# Altium project ZVSChargeSource.PrjPCB
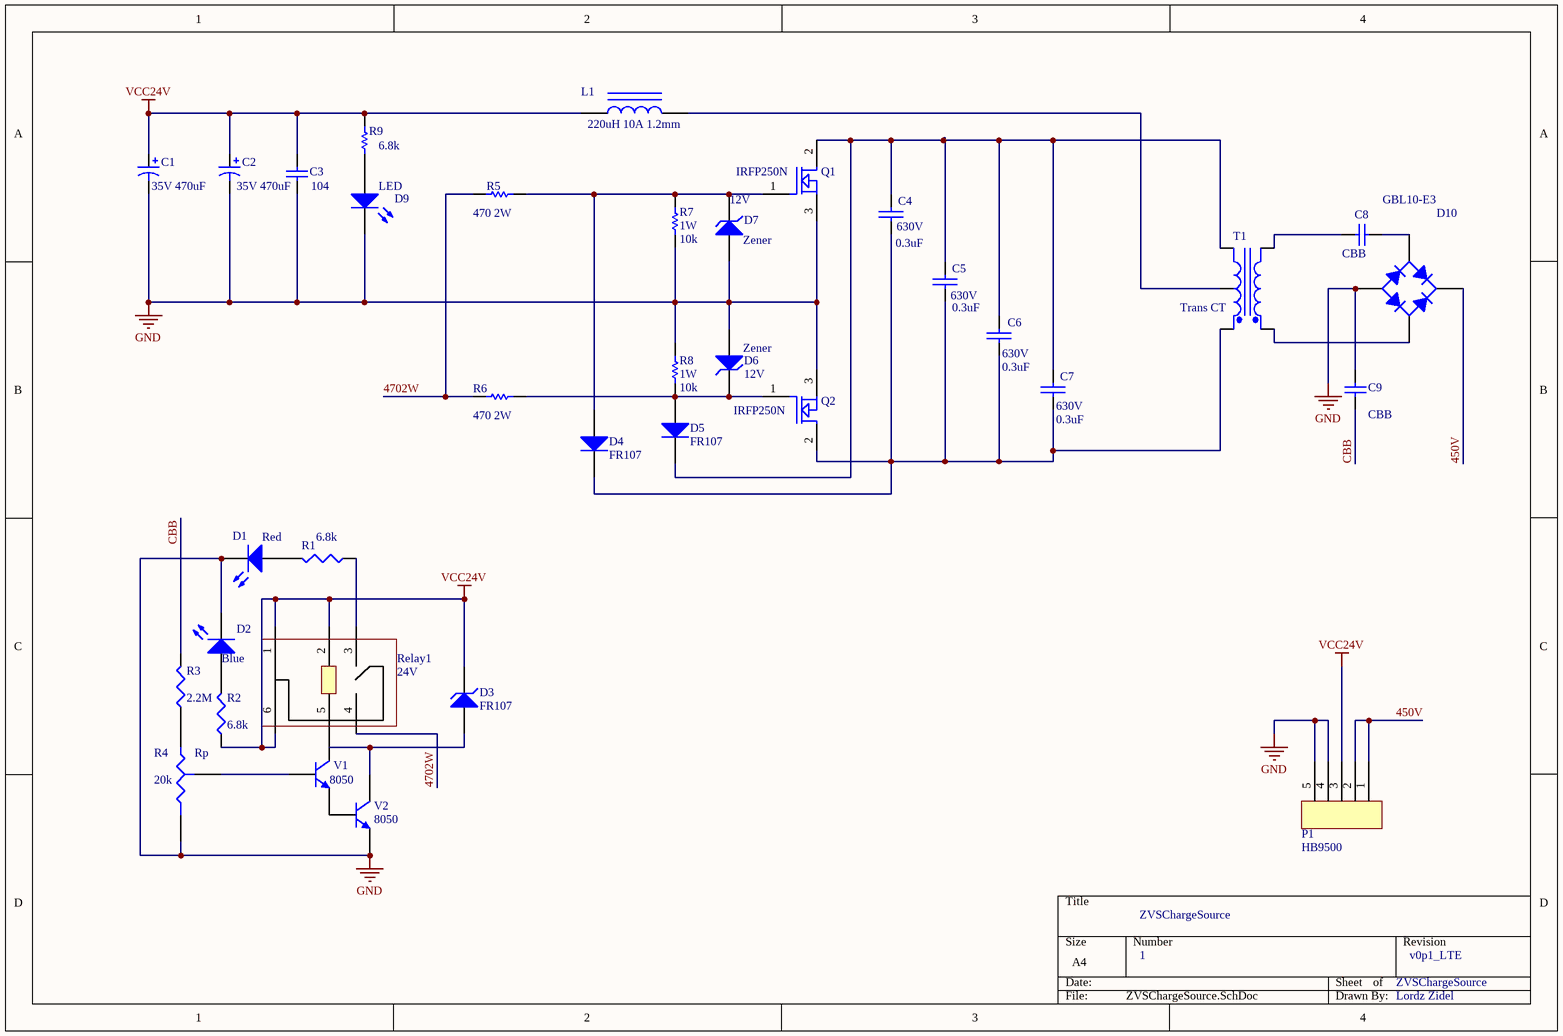
[diagram p0: ZVSChargeSource.SchDoc]
1 sheet, 35 parts. Net scope: global (net labels, ports and power ports of the same name join across sheets).

## Sheet ZVSChargeSource.SchDoc: ZVSChargeSource
size A4; Author: Lordz Zidel; Engineer: Lordz Zidel; Organization: T.WKVER; DocumentNumber: 1; Revision: v0p1_LTE; SheetNumber: 1; DocumentName: ZVSChargeSource; ProjectName: ZVSChargeSource

### Parts
C1  value 35V 470uF  [C4_5_10mm]
C2  value 35V 470uF  [C4_5_10mm]
C3  value 104  [RAD-0.3]
C4  value 630V  Capacitance: 0.3uF  [MKP_Capacitor]
C5  value 630V  Capacitance: 0.3uF  [MKP_Capacitor]
C6  value 630V  Capacitance: 0.3uF  [MKP_Capacitor]
C7  value 630V  Capacitance: 0.3uF  [MKP_Capacitor]
C8  value CBB  [MKP_Capacitor]
C9  value CBB  [MKP_Capacitor]
D1  (no value)  [0805]
D2  (no value)  [0805]
D3  FR107  [DIODE-0.4]
D4  FR107  [DIODE-0.4]
D5  FR107  [DIODE-0.4]
D6  12V  [DIODE-0.4]
D7  12V  [DIODE-0.4]
D9  (no value)  [0805]
D10  GBL10-E3  [GBL10-E3]
L1  value 220uH 10A 1.2mm  [HBL_30_10_H]
P1  HB9500  [CJ_10x5]
Q1  IRFP250N  [TO-247AC_ZCEDGE]
Q2  IRFP250N  [TO-247AC_ZCEDGE]
R1  value 6.8k  [0805R]
R2  value 6.8k  [0805R]
R3  value 2.2M  [0805R]
R4  Rp  value 20k  [ResTap3296]
R5  value 470 2W  [2WZC]
R6  value 470 2W  [2WZC]
R7  1W  value 10k  [1WZC]
R8  1W  value 10k  [1WZC]
R9  value 6.8k  [AXIAL-0.3]
Relay1  Relay?  [Relay_HK4100F_6p]  (value not drawn)
T1  Trans CT  [TRF_5]
V1  8050  [sot-23]
V2  8050  [sot-23]

### Nets
GND: C1.2 C2.2 C3.1 C9.2 D1.2(K) D2.2(K) D6.1(A) D7.1(A) D9.2(K) D10.3(A) P1.4 P1.5 Q1.3(S) Q2.3(S) R4.2(B) R7.2 R8.1 V2.2(E)
VCC24V: C1.1 C2.1 C3.2 D3.2(K) L1.1 P1.3 R2.1 R9.2 Relay1.1 Relay1.2 Relay1.6
450V: D10.1(K) P1.1 P1.2
4702W: R5.2 R6.2 Relay1.4
CBB: C9.1 R3.2
NetC4_1: C4.1 C5.1 C6.1 C7.1 D5.2(K) Q1.2(D) T1.5(Sec-)
NetC4_2: C4.2 C5.2 C6.2 C7.2 D4.2(K) Q2.2(D) T1.3(Sec+)
NetC8_1: C8.1 T1.2(Pri-)
NetC8_2: C8.2 D10.4(C)
NetD1_1: D1.1(A) R1.2
NetD2_1: D2.1(A) R2.2
NetD3_1: D3.1(A) V2.3(C)
NetD4_1: D4.1(A) D7.2(K) Q1.1(G) R5.1 R7.1
NetD5_1: D5.1(A) D6.2(K) Q2.1(G) R6.1 R8.2
NetD9_1: D9.1(A) R9.1
NetD10_2: D10.2(C) T1.1(Pri+)
NetL1_2: L1.2 T1.4(SecCT)
NetR1_1: R1.1 Relay1.3
NetR3_1: R3.1 R4.1(A)
NetR4_3: R4.3(TAP) V1.1(B)
NetRelay1_5: Relay1.5 V1.3(C)
NetV1_2: V1.2(E) V2.1(B)

### Notes on the sheet
- (near D9) LED
- (near D7) Zener
- (near D6) Zener
- (near D1) Red
- (near D2) Blue
- 24V

### Library data of the parts
C1 C2 = Cap Pol1: Polarized Capacitor (Radial); pin to pad: 1>2 2>1; Published: 8-Jun-2000; LatestRevisionDate: 17-Jul-2002; LatestRevisionNote: Re-released for DXP Platform.; PackageReference: RB7.6-15; Publisher: Altium Limited; PackageDescription: Polarized Capacitor (Radial); 2 Leads
C3 C8 C9 = Cap: Capacitor; Published: 8-Jun-2000; LatestRevisionDate: 17-Jul-2002; LatestRevisionNote: Re-released for DXP Platform.; PackageReference: RAD-0.3; Publisher: Altium Limited; PackageDescription: Radial Cap, Thru-Hole; 2 Leads; 0.3 in Pin Spacing
C4-C7 = 普通电容: Capacitor
D1 D2 = LED2: Typical RED, GREEN, YELLOW, AMBER GaAs LED; Published: 8-Jun-2000; LatestRevisionDate: 17-Jul-2002; LatestRevisionNote: Re-released for DXP Platform.; PackageVersion: Feb-2002; PackageReference: 3.2X1.6X1.1; Publisher: Altium Limited; PackageDescription: SM LED; 2 Flat Leads
D3 D6 D7 = D Zener: Zener Diode; Published: 8-Jun-2000; LatestRevisionDate: 17-Jul-2002; LatestRevisionNote: Re-released for DXP Platform.; PackageReference: DIODE-0.7; Publisher: Altium Limited; PackageDescription: Diode, Thru-Hole; 2 Leads; 0.7 in Pin Spacing
D4 D5 = Diode 1N4007: 1 Amp General Purpose Rectifier; Published: 8-Jun-2000; LatestRevisionDate: 17-Jul-2002; LatestRevisionNote: Re-released for DXP Platform.; DatasheetVersion: 1998; PackageVersion: Aug-1999; PackageReference: DO-41; Publisher: Altium Limited; PackageDescription: Diode, Axial; Body 5.2 x 2.7 mm (LxDia. max), Lead Dia. 0.86 mm (max); Code_JEDEC: DO-204-AL; ComponentLink1Description: Manufacturer Link; ComponentLink1URL: http://www.fairchildsemi.com/; ComponentLink2Description: Datasheet; ComponentLink2URL: http://www.fairchildsemi.com/ds/1N%2F1N4001.pdf
D9 = LED3: Typical BLUE SiC LED; Published: 8-Jun-2000; LatestRevisionDate: 17-Dec-2003; LatestRevisionNote: PCB Footprint replaced.; DatasheetVersion: 16-Apr-2002; PackageVersion: 16-Apr-2002; PackageReference: 3.5X2.8X1.9; Publisher: Altium Limited; PackageDescription: SM LED; 2 C-Bend Leads; Body 3.5 x 2.8 x 1.9 mm, inc leads (LxWxH typ)
D10 = Bridge1: Full Wave Diode Bridge; Published: 8-Jun-2000; LatestRevisionDate: 29-May-2009; LatestRevisionNote: Sch pins A & K swapped.; DatasheetVersion: E2732B; PackageReference: D-38; Publisher: Altium Limited; PackageDescription: Bridge Rectifier; 4 Terminals; Body 9.4 x 9.4 mm (typ); Pitch 5.08 mm
L1 = Inductor Iron: Magnetic-Core Inductor; Published: 24-Mar-1999; LatestRevisionDate: 17-Jul-2002; LatestRevisionNote: Re-released for DXP Platform.; PackageReference: AXIAL-0.9; Publisher: Altium Limited; PackageDescription: Axial Device, Thru-Hole; 2 Leads; 0.9 in Pin Spacing
P1 = WJ5P_381
Q1 Q2 = MOSFET N: pin to pad: 1>G 2>D 3>S; Max Voltage: 200V; Max Current: 50A
R1-R3 = Res3: Resistor; Published: 8-Jun-2000; LatestRevisionDate: 29-May-2009; LatestRevisionNote: IPC-7351 Footprint Added.; PackageReference: J1-0603; Publisher: Altium Limited; PackageDescription: Chip Resistor
R4 = Res Tap: Tapped Resistor; Sim Note: Enter the Resistance value and the set point into parameter fields.; Set Position: 0.5; Published: 24-Mar-1999; LatestRevisionDate: 17-Jul-2002; LatestRevisionNote: Re-released for DXP Platform.; PackageReference: VR3; Publisher: Altium Limited; PackageDescription: Variable Resistor, Thru-Hole; 3 Leads
R5-R9 = Res1: Resistor; Published: 8-Jun-2000; LatestRevisionDate: 17-Jul-2002; LatestRevisionNote: Re-released for DXP Platform.; PackageReference: AXIAL-0.3; Publisher: Altium Limited; PackageDescription: Axial Device, Thru-Hole; 2 Leads; 0.3 in Pin Spacing
Relay1 = Relay_HK4100F_6p
T1 = Trans CT: Center-Tapped Transformer (Coupled Inductor Model); Published: 8-Jun-2000; LatestRevisionDate: 17-Jul-2002; LatestRevisionNote: Re-released for DXP Platform.; PackageReference: TRF_5; Publisher: Altium Limited; PackageDescription: Transformer; 5 Leads
V1 V2 = NPN: NPN Bipolar Transistor; Published: 8-Jun-2000; LatestRevisionDate: 17-Jul-2002; LatestRevisionNote: Re-released for DXP Platform.; PackageReference: TO-226; Publisher: Altium Limited; Code_JEDEC: TO-226-AA